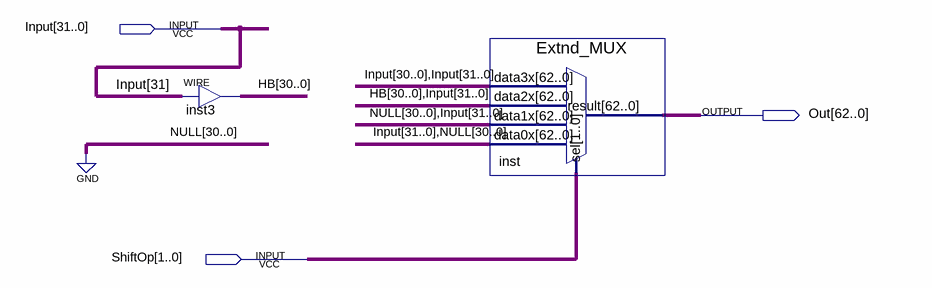
[diagram p0: schematic sheet]
// Quartus schematic extender_module.bdf as structural Verilog: 2 symbols, 3 pins
module extender_module (
  input  [31:0] Input,
  input  [1:0] ShiftOp,
  output [62:0] Out
);

  wire [30:0] HB;

  assign HB = {31{Input[31]}};  // WIRE inst3
  Extnd_MUX inst (
    .data3x({Input[30:0], Input}), .data2x({HB, Input}), .data1x({{31{1'b0}}, Input}),
    .data0x({Input, {31{1'b0}}}), .sel(ShiftOp), .result(Out));
endmodule
